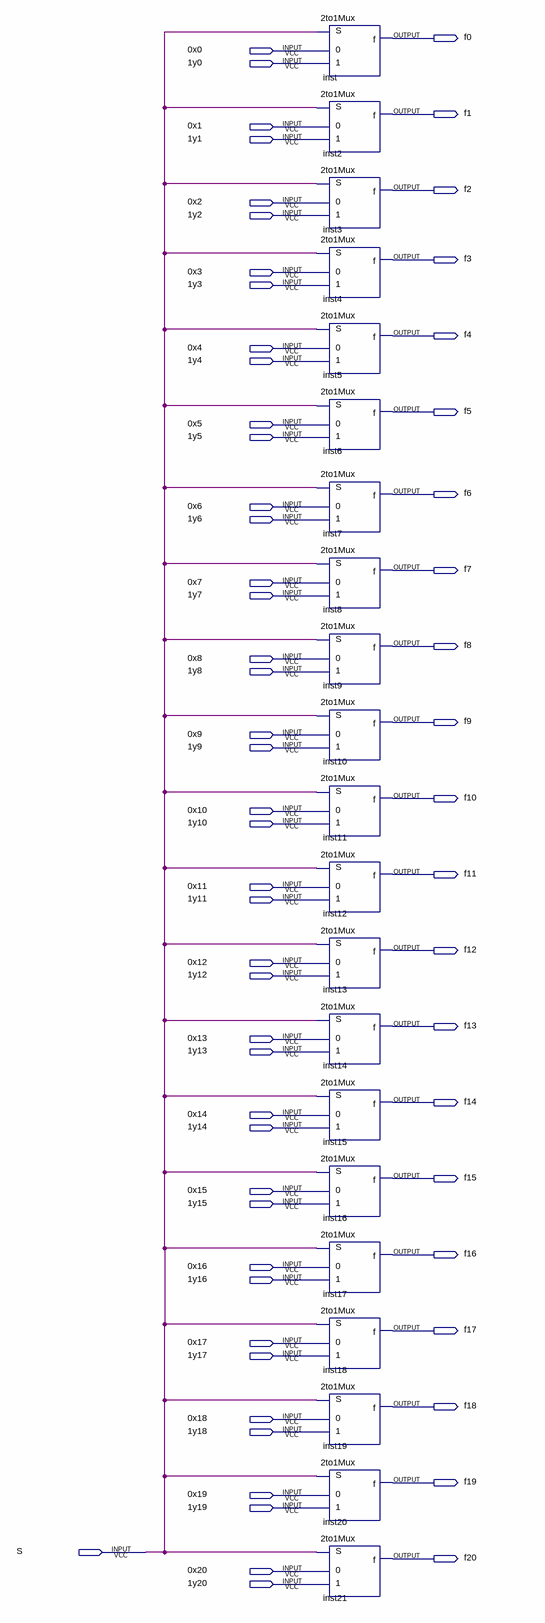
[diagram p0: schematic sheet]
// Quartus schematic 21Muxes.bdf as structural Verilog: 21 symbols, 64 pins
module \21Muxes  (
  input  \0x0 ,
  input  \1y0 ,
  input  \0x1 ,
  input  \1y1 ,
  input  \0x2 ,
  input  \1y2 ,
  input  \0x3 ,
  input  \1y3 ,
  input  \0x4 ,
  input  \1y4 ,
  input  \0x5 ,
  input  \1y5 ,
  input  \0x6 ,
  input  \1y6 ,
  input  \0x7 ,
  input  \1y7 ,
  input  \0x8 ,
  input  \1y8 ,
  input  \0x9 ,
  input  \1y9 ,
  input  \0x10 ,
  input  \1y10 ,
  input  \0x11 ,
  input  \1y11 ,
  input  \0x12 ,
  input  \1y12 ,
  input  \0x13 ,
  input  \1y13 ,
  input  \0x14 ,
  input  \1y14 ,
  input  \0x15 ,
  input  \1y15 ,
  input  \0x16 ,
  input  \1y16 ,
  input  \0x17 ,
  input  \1y17 ,
  input  \0x18 ,
  input  \1y18 ,
  input  \0x19 ,
  input  \1y19 ,
  input  S,
  input  \0x20 ,
  input  \1y20 ,
  output f0,
  output f1,
  output f2,
  output f3,
  output f4,
  output f5,
  output f6,
  output f7,
  output f8,
  output f9,
  output f10,
  output f11,
  output f12,
  output f13,
  output f14,
  output f15,
  output f16,
  output f17,
  output f18,
  output f19,
  output f20
);

  \2to1Mux  inst (.\0 (\0x0 ), .S(S), .\1 (\1y0 ), .f(f0));
  \2to1Mux  inst2 (.\0 (\0x1 ), .S(S), .\1 (\1y1 ), .f(f1));
  \2to1Mux  inst3 (.\0 (\0x2 ), .S(S), .\1 (\1y2 ), .f(f2));
  \2to1Mux  inst4 (.\0 (\0x3 ), .S(S), .\1 (\1y3 ), .f(f3));
  \2to1Mux  inst5 (.\0 (\0x4 ), .S(S), .\1 (\1y4 ), .f(f4));
  \2to1Mux  inst6 (.\0 (\0x5 ), .S(S), .\1 (\1y5 ), .f(f5));
  \2to1Mux  inst7 (.\0 (\0x6 ), .S(S), .\1 (\1y6 ), .f(f6));
  \2to1Mux  inst8 (.\0 (\0x7 ), .S(S), .\1 (\1y7 ), .f(f7));
  \2to1Mux  inst9 (.\0 (\0x8 ), .S(S), .\1 (\1y8 ), .f(f8));
  \2to1Mux  inst10 (.\0 (\0x9 ), .S(S), .\1 (\1y9 ), .f(f9));
  \2to1Mux  inst11 (.\0 (\0x10 ), .S(S), .\1 (\1y10 ), .f(f10));
  \2to1Mux  inst12 (.\0 (\0x11 ), .S(S), .\1 (\1y11 ), .f(f11));
  \2to1Mux  inst13 (.\0 (\0x12 ), .S(S), .\1 (\1y12 ), .f(f12));
  \2to1Mux  inst14 (.\0 (\0x13 ), .S(S), .\1 (\1y13 ), .f(f13));
  \2to1Mux  inst15 (.\0 (\0x14 ), .S(S), .\1 (\1y14 ), .f(f14));
  \2to1Mux  inst16 (.\0 (\0x15 ), .S(S), .\1 (\1y15 ), .f(f15));
  \2to1Mux  inst17 (.\0 (\0x16 ), .S(S), .\1 (\1y16 ), .f(f16));
  \2to1Mux  inst18 (.\0 (\0x17 ), .S(S), .\1 (\1y17 ), .f(f17));
  \2to1Mux  inst19 (.\0 (\0x18 ), .S(S), .\1 (\1y18 ), .f(f18));
  \2to1Mux  inst20 (.\0 (\0x19 ), .S(S), .\1 (\1y19 ), .f(f19));
  \2to1Mux  inst21 (.\0 (\0x20 ), .S(S), .\1 (\1y20 ), .f(f20));
endmodule
